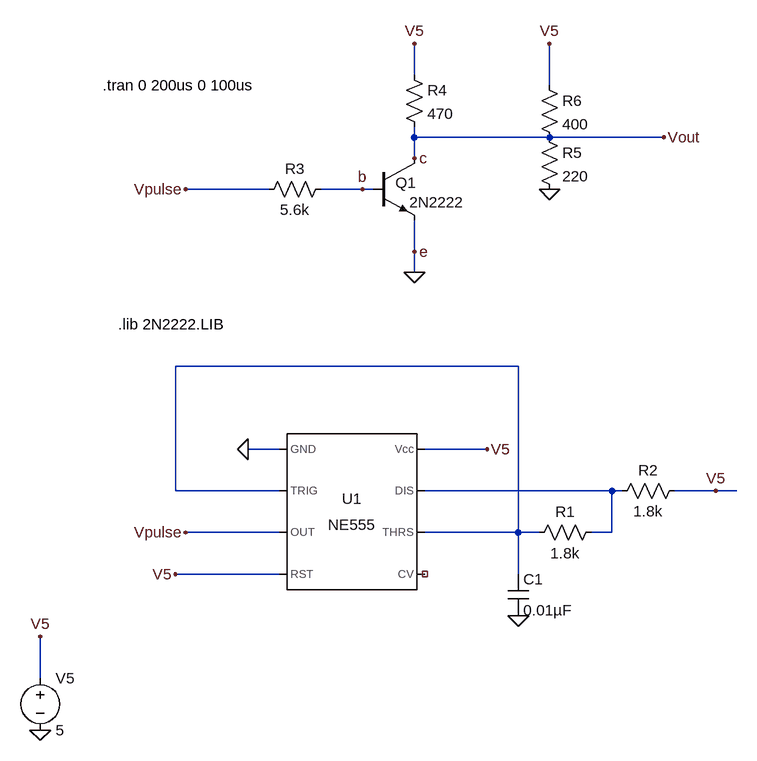
[diagram p0: schematic TX.asc]
TX.asc, the LTspice schematic file:
Version 4
SHEET 1 880 1136
WIRE -768 112 -768 64
WIRE -560 128 -560 64
WIRE -768 208 -768 192
WIRE -560 208 -768 208
WIRE -384 208 -560 208
WIRE -768 240 -768 208
WIRE -992 288 -1120 288
WIRE -848 288 -912 288
WIRE -832 288 -848 288
WIRE -768 384 -768 336
WIRE -768 416 -768 384
WIRE -608 560 -1136 560
WIRE -976 688 -1024 688
WIRE -656 688 -752 688
WIRE -1136 752 -1136 560
WIRE -976 752 -1136 752
WIRE -464 752 -752 752
WIRE -448 752 -464 752
WIRE -304 752 -368 752
WIRE -272 752 -304 752
WIRE -976 816 -1120 816
WIRE -608 816 -608 560
WIRE -608 816 -752 816
WIRE -576 816 -608 816
WIRE -464 816 -464 752
WIRE -464 816 -496 816
WIRE -976 880 -1136 880
WIRE -608 880 -608 816
WIRE -1344 1040 -1344 976
FLAG -768 416 0
FLAG -384 208 Vout
FLAG -560 288 0
FLAG -1024 688 0
FLAG -1344 1120 0
FLAG -1344 976 V5
FLAG -656 688 V5
FLAG -1120 816 Vpulse
FLAG -1136 880 V5
FLAG -608 944 0
FLAG -304 752 V5
FLAG -768 64 V5
FLAG -1120 288 Vpulse
FLAG -768 384 e
FLAG -848 288 b
FLAG -768 240 c
FLAG -560 64 V5
SYMBOL npn -832 240 R0
WINDOW 0 35 38 Left 2
SYMATTR InstName Q1
SYMATTR Value 2N2222
SYMBOL res -784 96 R0
SYMATTR InstName R4
SYMATTR Value 470
SYMBOL res -896 272 R90
WINDOW 0 0 56 VBottom 2
WINDOW 3 32 56 VTop 2
SYMATTR InstName R3
SYMATTR Value 5.6k
SYMBOL res -576 192 R0
SYMATTR InstName R5
SYMATTR Value 220
SYMBOL NE555 -864 784 R0
SYMATTR InstName U1
SYMBOL voltage -1344 1024 R0
SYMATTR InstName V5
SYMATTR Value 5
SYMBOL cap -624 880 R0
SYMATTR InstName C1
SYMATTR Value 0.01µF
SYMBOL res -480 800 R90
WINDOW 0 0 56 VBottom 2
WINDOW 3 32 56 VTop 2
SYMATTR InstName R1
SYMATTR Value 1.8k
SYMBOL res -352 736 R90
WINDOW 0 0 56 VBottom 2
WINDOW 3 32 56 VTop 2
SYMATTR InstName R2
SYMATTR Value 1.8k
SYMBOL res -576 112 R0
SYMATTR InstName R6
SYMATTR Value 400
TEXT -1248 128 Left 2 !.tran 0 200us 0 100us
TEXT -1224 496 Left 2 !.lib 2N2222.LIB

The netlist it stands for:
* TX.asc
Q1 c b 0 0 2N2222
R4 V5 c 470
R3 b Vpulse 5.6k
R5 c 0 220
XU1 0 N001 Vpulse V5 NC_01 N001 N002 V5 NE555  ; pins GND TRIG OUT RST CV THRS DIS Vcc
V5 V5 0 5
C1 N001 0 0.01µF
R1 N002 N001 1.8k
R2 V5 N002 1.8k
R6 V5 c 400
.model NPN NPN
.model PNP PNP
.lib standard.bjt
.tran 0 200us 0 100us
.lib 2N2222.LIB
.lib NE555.sub
.backanno
.end